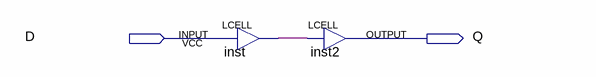
[diagram p0: schematic sheet]
// Quartus schematic dummy.bdf as structural Verilog: 2 symbols, 2 pins
module dummy (
  input  D,
  output Q
);

  wire inst_out;

  LCELL inst (.IN(D), .OUT(inst_out));
  LCELL inst2 (.IN(inst_out), .OUT(Q));
endmodule
